# EAGLE design MagEnc2 (EAGLE 5.11)
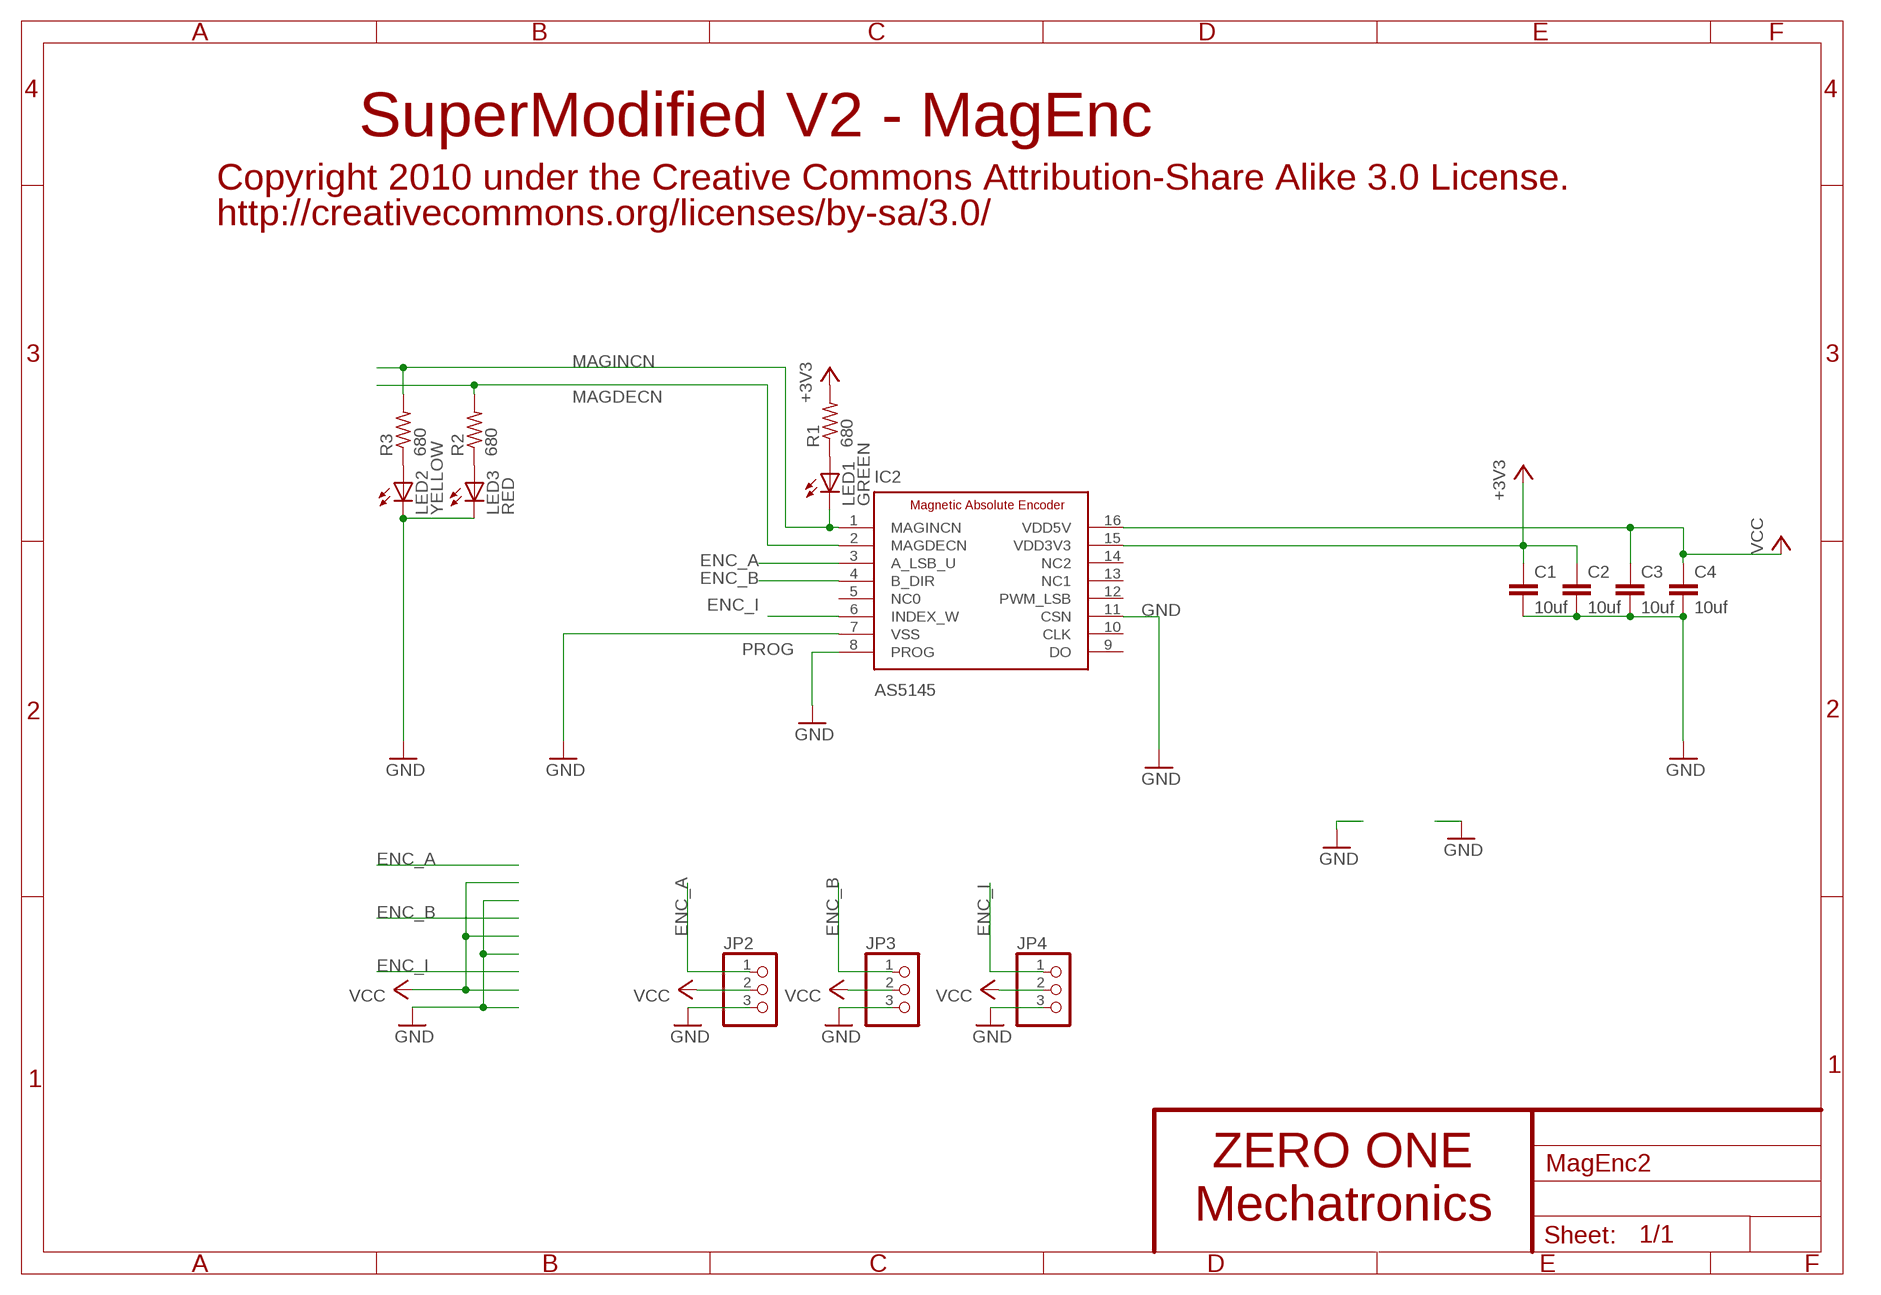
[diagram p0: schematic, sheet 1]

## Parts
C1  10uf  C-EUC0805K  [C0805K]
C2  10uf  C-EUC0805K  [C0805K]
C3  10uf  C-EUC0805K  [C0805K]
C4  10uf  C-EUC0805K  [C0805K]
IC2  AS5145  ADS5040  [SSOP16]
JP2  PINHD-1X3  [1X03]
JP3  PINHD-1X3  [1X03]
JP4  PINHD-1X3  [1X03]
LED1  GREEN  LEDCHIPLED_0805  [CHIPLED_0805]
LED2  YELLOW  LEDCHIPLED_0805  [CHIPLED_0805]
LED3  RED  LEDCHIPLED_0805  [CHIPLED_0805]
R1  680  R-US_R0603  [R0603]
R2  680  R-US_R0603  [R0603]
R3  680  R-US_R0603  [R0603]

## Nets
+3V3: C1.1 C2.1 IC2.15(VDD3V3) R1.2
ENC_A: IC2.3(A_LSB_U) JP2.1
ENC_B: IC2.4(B_DIR) JP3.1
ENC_I: IC2.6(INDEX_W) JP4.1
GND: C1.2 C2.2 C3.2 C4.2 IC2.7(VSS) IC2.11(CSN) JP2.3 JP3.3 JP4.3 LED2.C LED3.C
MAGDECN: IC2.2(MAGDECN) R2.2
MAGINCN: IC2.1(MAGINCN) LED1.C R3.2
N$1: LED1.A R1.1
N$4: LED3.A R2.1
N$5: LED2.A R3.1
PROG: IC2.8(PROG) ; supply symbol labelled GND
VCC: C3.1 C4.1 IC2.16(VDD5V) JP2.2 JP3.2 JP4.2
Unconnected: IC2.5(NC0) IC2.9(DO) IC2.10(CLK) IC2.12(PWM_LSB) IC2.13(NC1) IC2.14(NC2)

## Notes on the sheet
- SuperModified V2 - MagEnc
- Copyright 2010 under the Creative Commons Attribution-Share Alike 3.0 License.
- http://creativecommons.org/licenses/by-sa/3.0/
- ZERO ONE
- Mechatronics

## Library data of the parts
C1-C4 = rcl:C-EU: CAPACITOR, European symbol
IC2 = zo_TMS320DMC:ADS5040
JP2-JP4 = pinhead:PINHD-1X3: PIN HEADER
LED1-LED3 = led:LED: LED OSRAM: - CHIPLED LG R971, LG N971, LY N971, LG Q971, LY Q971, LO R971, LY R971 LH N974, LH R974 LS Q976, LO Q976, LY Q976 LO Q996 - Hyper CHIPLED LW Q18S LB Q993, LB Q99A, LB R99A - SideLED LS A670, LO A670, LY A670, LG A670, LP A670 LB A673, LV A673, LT A673, LW A673 LH A674 LY A675 LS A676, LA A676, LO A676, LY A676, LW A676 LS A679, LY A679, LG A679 - Hyper Micro SIDELED® LS Y876, LA Y876, LO Y876, LY Y876 LT Y87S - SmartLED LW L88C, LW L88S LB L89C, LB L89S, LG L890 LS L89K, LO L89K, LY L89K LS L896, LA L896, LO L896, LY L896 - TOPLED LS T670, LO T670, LY T670, LG T670, LP T670 LSG T670, LSP T670, LSY T670, LOP T670, LYG T670 LG T671, LOG T671, LSG T671 LB T673, LV T673, LT T673, LW T673 LH T674 LS T676, LA T676, LO T676, LY T676, LB T676, LH T676, LSB T676, LW T676 LB T67C, LV T67C, LT T67C, LS T67K, LO T67K, LY T67K, LW E67C LS E67B, LA E67B, LO E67B, LY E67B, LB E67C, LV E67C, LT E67C LW T67C LS T679, LY T679, LG T679 LS T770, LO T770, LY T770, LG T770, LP T770 LB T773, LV T773, LT T773, LW T773 LH T774 LS E675, LA E675, LY E675, LS T675 LS T776, LA T776, LO T776, LY T776, LB T776 LHGB T686 LT T68C, LB T68C - Hyper Mini TOPLED® LB M676 - Mini TOPLED Santana® LG M470 LS M47K, LO M47K, LY M47K Source: http://www.osram.convergy.de/
R1-R3 = rcl:R-US_: RESISTOR, American symbol

## Board
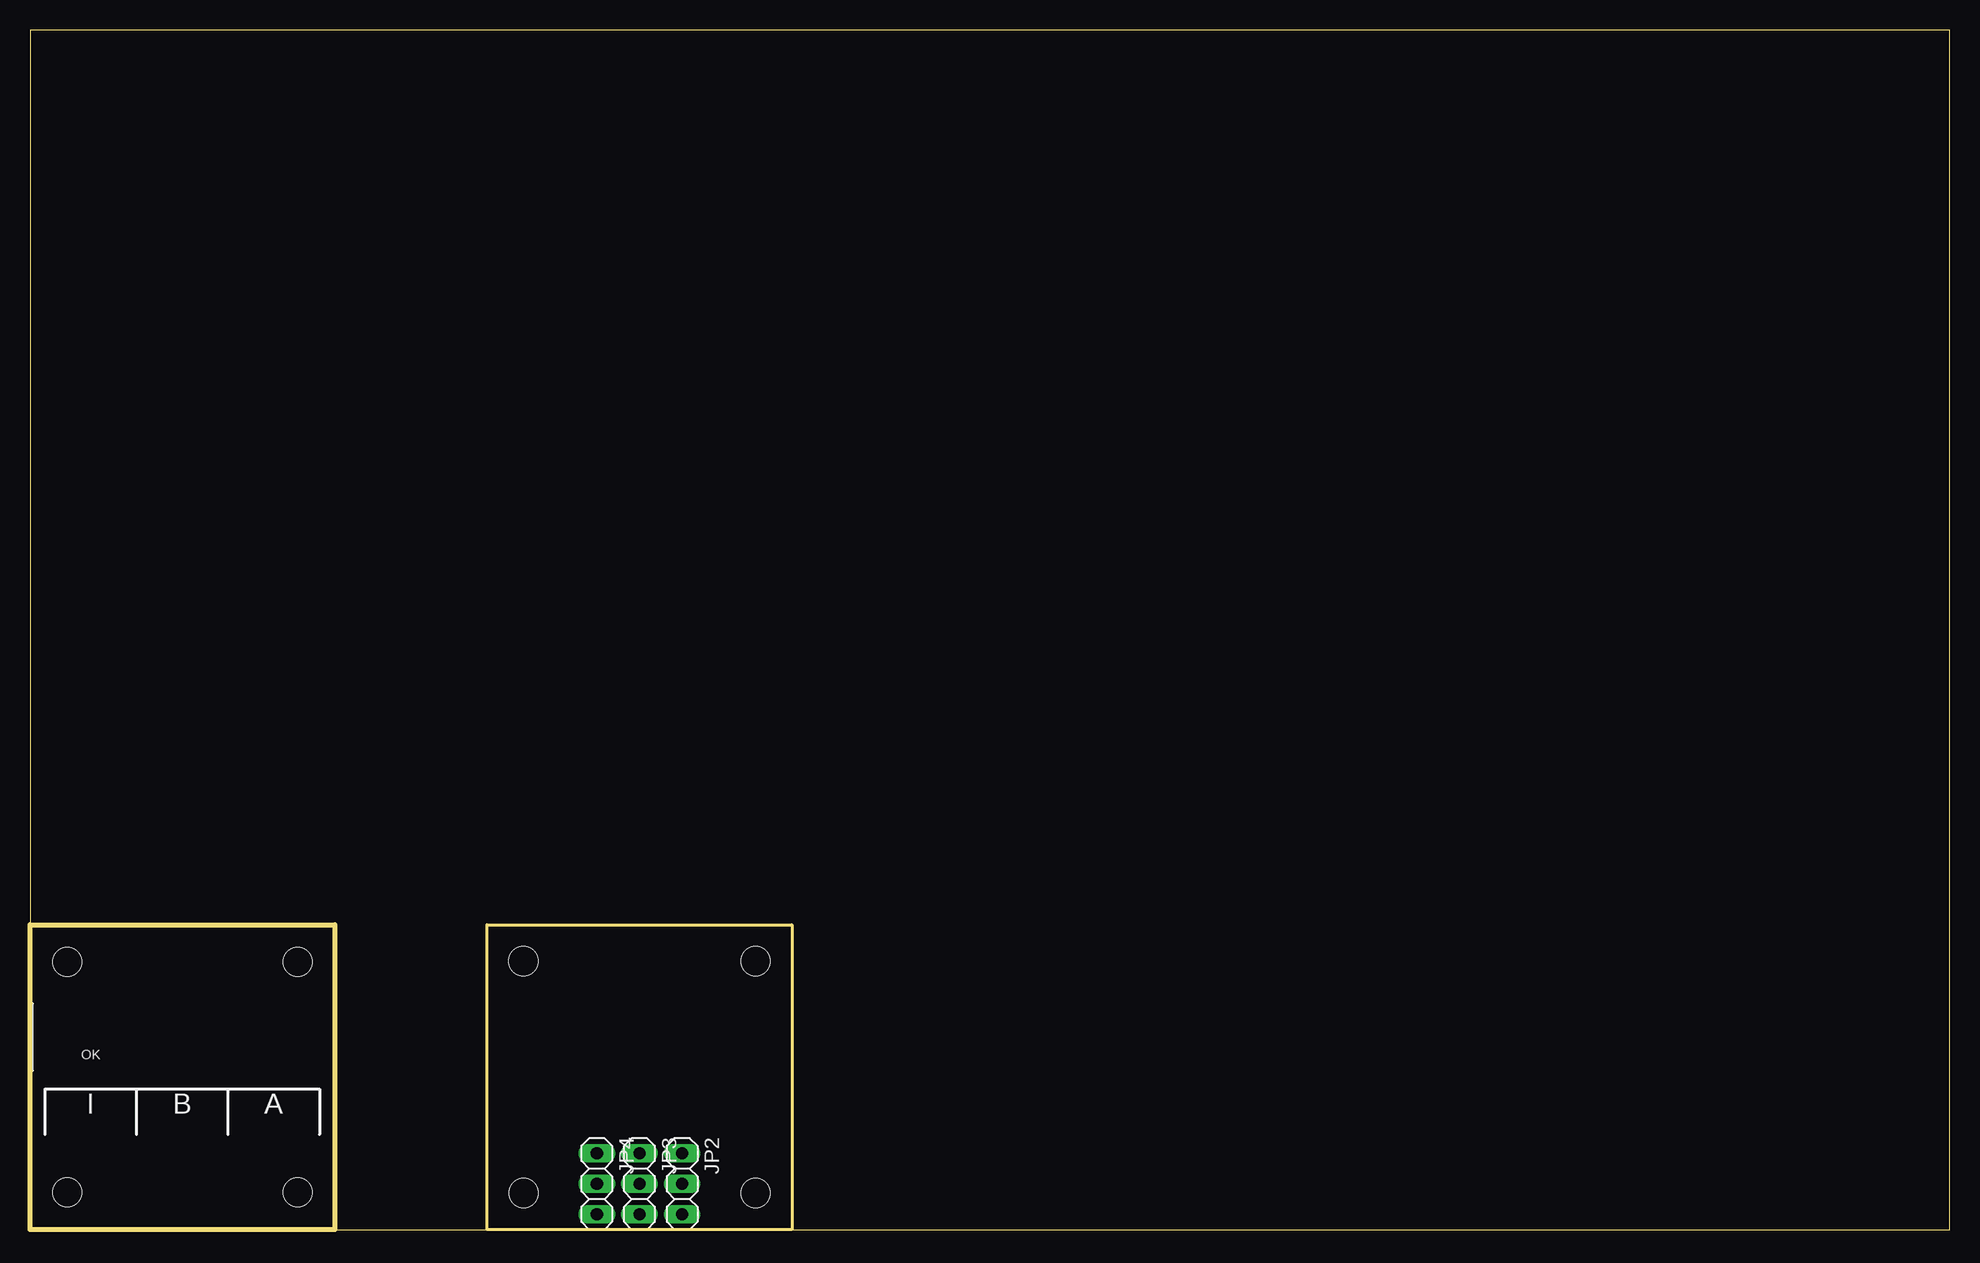
[diagram p1: board, top side]
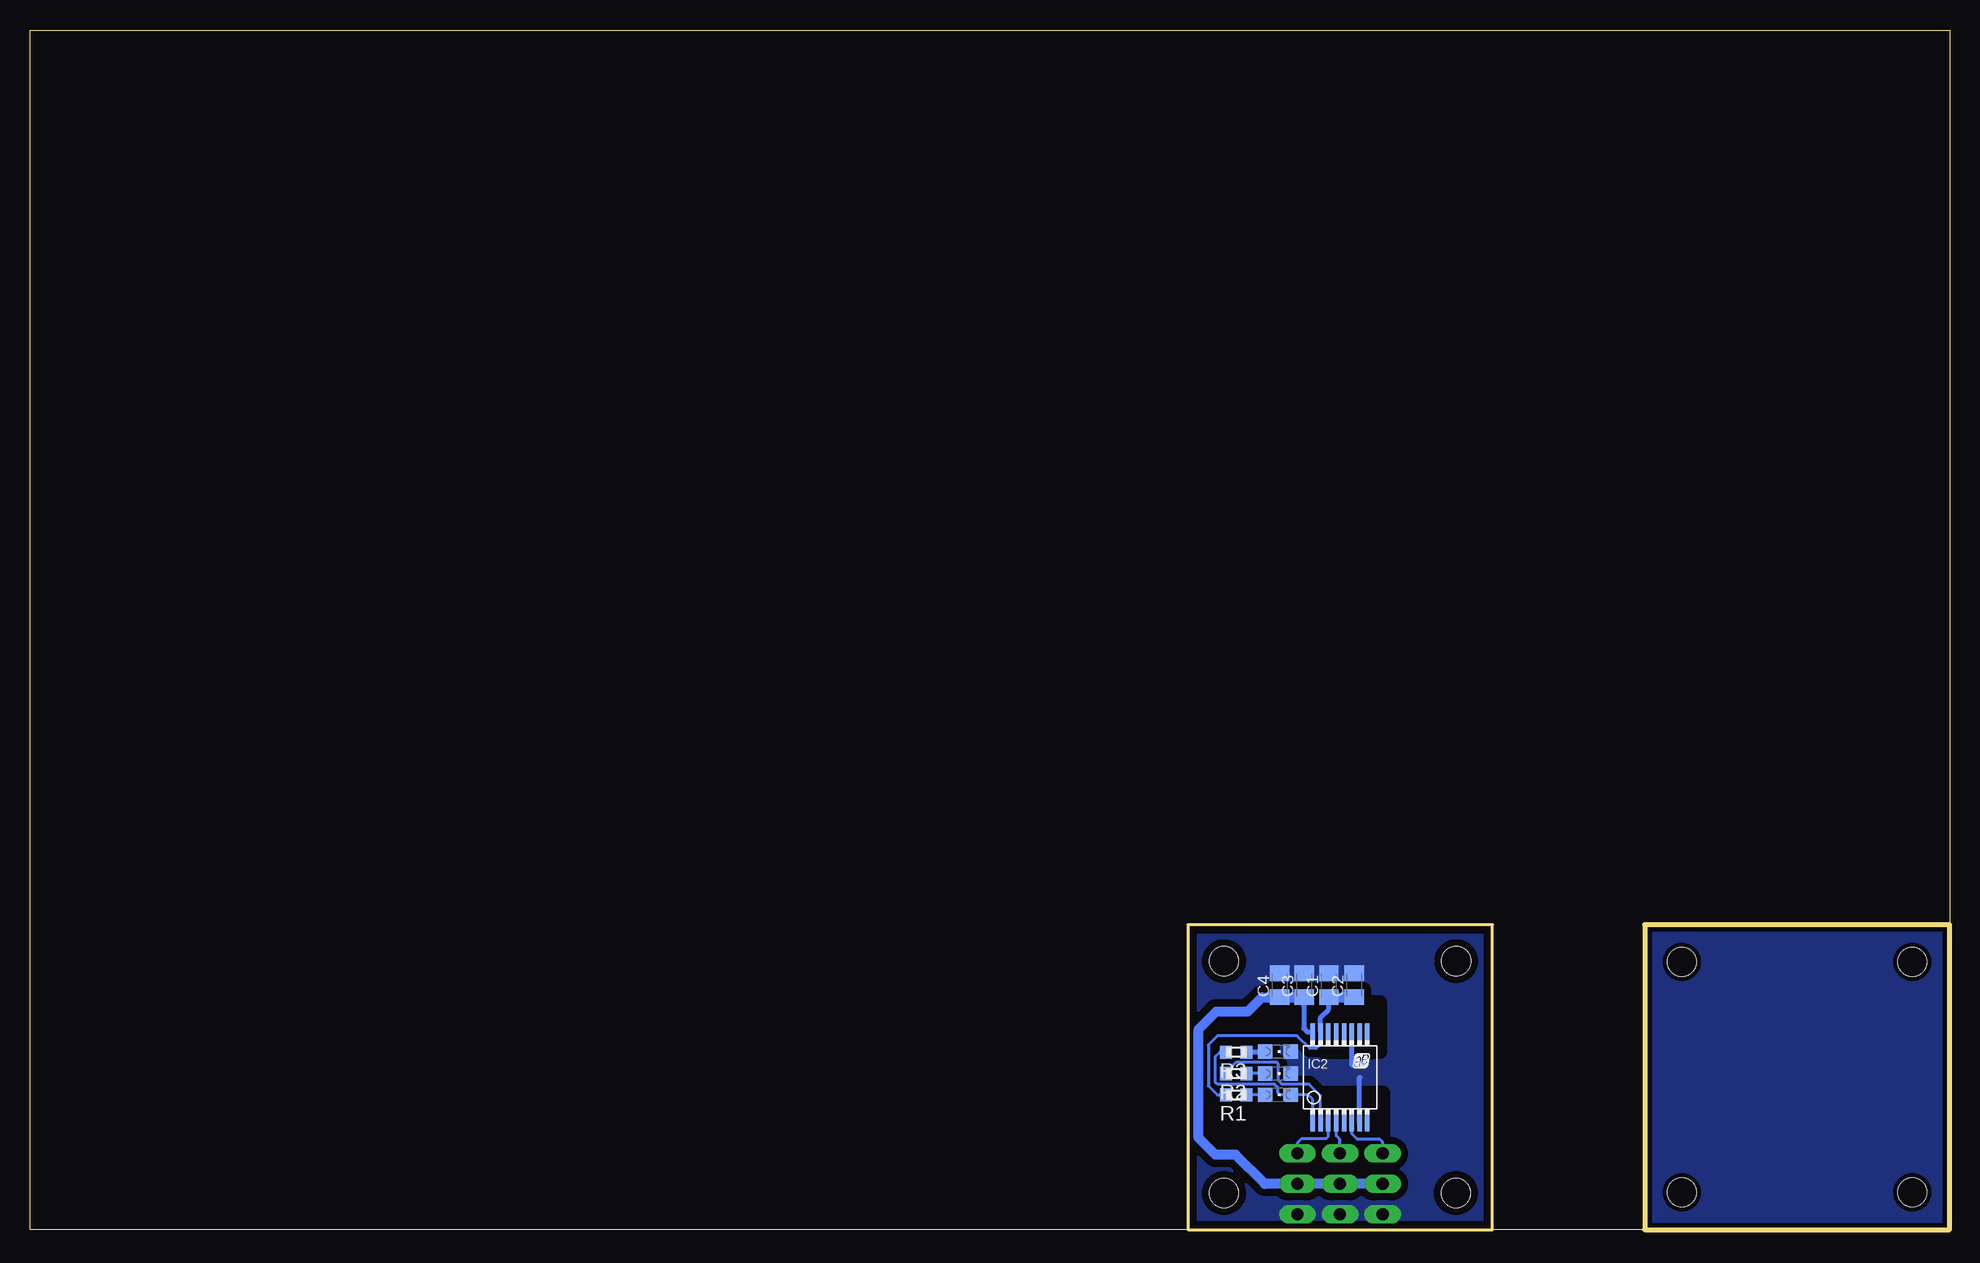
[diagram p2: board, bottom side, seen from below]

Size 160 x 100 mm. Coordinates in mm from the lower left corner, seen from the top.
Outline: 25.4,0 38.1,0
Outline: 63.5,0 160,0 160,100 0,100 0,25.4
Outline: 0,25.4 0,0 25.4,0
Outline: 0,25.4 25.4,25.4 25.4,0
Outline: 38.1,0 38.1,25.4 63.5,25.4 63.5,0
Outline: 63.5,0 38.1,0
Copper layers (1*16): Top 0.035mm / dielectric 1.5mm / Bottom 0.035mm
Design rules "default *": minimum track width 10mil, minimum drill 24mil, track to track 6mil, track to pad 6mil, pad to pad 6mil, via to via 6mil, smd to smd 6mil, copper to edge 15mil, drill to drill 8mil, minimum pad ring 10mil, minimum via ring 8mil, stop-mask expansion 4mil, vias tented up to drill 0mil, thermal gap 10mil
Holes 2.41 mm at -9.86,-1.88 3.1,22.3 22.3,22.3 3.1,3.1 22.3,3.1 41.12,22.38 60.48,22.38 60.48,3.05 41.15,3.05
bRestrict: area 48.3,17.7 to 51,18.3; area 47.5,14.8 to 48.2,18.9; area 48.2,14.8 to 49.6,15.3; area 47.2,10.1 to 51.8,11.4; area 47.2,8 to 48,10; area 50.1,14.8 to 51.5,15.3; area 50.7,14.8 to 52.1,15.3

### Footprints (pad centres in the part's own frame; a part is rotated, then mirrored left to right if it is on the bottom)
C0805K = smd 1.3 x 1.6: 1 -1,0; 2 1,0
SSOP16 = smd 0.381 x 1.422: 1 -2.275,-3.791; 2 -1.625,-3.791; 3 -0.975,-3.791; 4 -0.325,-3.791; 5 0.325,-3.791; 6 0.975,-3.791; 7 1.625,-3.791; 8 2.275,-3.791; 9 2.275,3.791; 10 1.625,3.791; 11 0.975,3.791; 12 0.325,3.791; 13 -0.325,3.791; 14 -0.975,3.791; 15 -1.625,3.791; 16 -2.275,3.791
1X03 = drill 1.016 long: 1 -2.54,0; 2 0,0; 3 2.54,0
CHIPLED_0805 = smd 1.2 x 1.2: A 0,-1.05; C 0,1.05
R0603 = smd 1 x 1.1: 1 -0.85,0; 2 0.85,0

### Placement (x,y rotation side)
C1  51.74,20.37 90 bottom
C2  49.63,20.37 90 bottom
C3  53.8,20.37 90 bottom
C4  55.83,20.37 90 bottom
IC2  50.8,12.7 0 bottom
JP2  54.36,3.81 270 top
JP3  50.8,3.81 270 top
JP4  47.24,3.81 270 top
LED1  55.98,11.23 270 bottom
LED2  55.98,14.83 270 bottom
LED3  55.98,13 270 bottom
R1  59.46,11.23 180 bottom
R2  59.46,13 180 bottom
R3  59.46,14.78 180 bottom

### Tracks (layer width: path | path; a pad name or v marks a point on that pad's centre or on a via)
+3V3
  Bottom 0.254: R1.2 61.04,11.23 61.77,11.96 61.77,15.39 61.01,16.15 54.38,16.15 53.31,15.09 52.78,15.09 52.42,15.44 IC2.15
  Bottom 0.406: C1.1 51.74,18.36 52.42,17.68 IC2.15
  Bottom 0.813: C1.1 C2.1
ENC_A
  Bottom 0.254: IC2.3 51.77,7.76 51.97,7.57 54,7.57 54.36,7.21 JP2.1
ENC_B
  Bottom 0.254: IC2.4 51.12,7.79 50.8,7.47 JP3.1
ENC_I
  Bottom 0.254: IC2.6 49.83,7.99 49.35,7.52 47.47,7.52 47.24,7.29 JP4.1
GND
  Bottom 0.406: IC2.7 49.2,8.93 49.2,12.68 49.12,12.68 | IC2.11 49.83,13.74 48.9,13.74
  pour Bottom (isolate 0.254, no thermals): 0,25.4 25.4,25.4 25.4,0.05 0,0.05
  pour Bottom (isolate 0.61, no thermals): 38.15,25.43 63.63,25.43 63.63,-0.08 38.15,-0.08
MAGDECN
  Bottom 0.254: IC2.2 52.42,11.15 53.39,12.12 55.65,12.12 55.96,12.42 55.96,13.79 56.08,13.92 59.49,13.92 59.99,13.41 59.99,13.32 R2.2
MAGINCN
  Bottom 0.254: IC2.1 53.08,10.84 53.47,11.23 LED1.C 55.78,11.23 55.98,11.43 55.98,11.84 56.26,12.12 61.04,12.12 61.19,12.27 61.19,14.43 60.83,14.78 R3.2
N$1
  Bottom 0.254: LED1.A R1.1
N$4
  Bottom 0.254: LED3.A R2.1
N$5
  Bottom 0.406: LED2.A 57.03,14.78 R3.1
VCC
  Bottom 0.254: C3.1 53.82,18.68
  Bottom 0.406: 53.82,18.68 53.82,16.76 53.55,16.49 IC2.16
  Bottom 0.813: JP4.2 JP3.2 JP2.2 57.07,3.81 59.51,6.25 61.19,6.25 62.59,7.64 62.59,16.69 61.14,18.14 61.14,18.19 58.5,18.19 57.31,19.37 C4.1 C3.1

### Text on the board
tPlace: OK | I | B | A